# Altium project YaSIf.PrjPcb
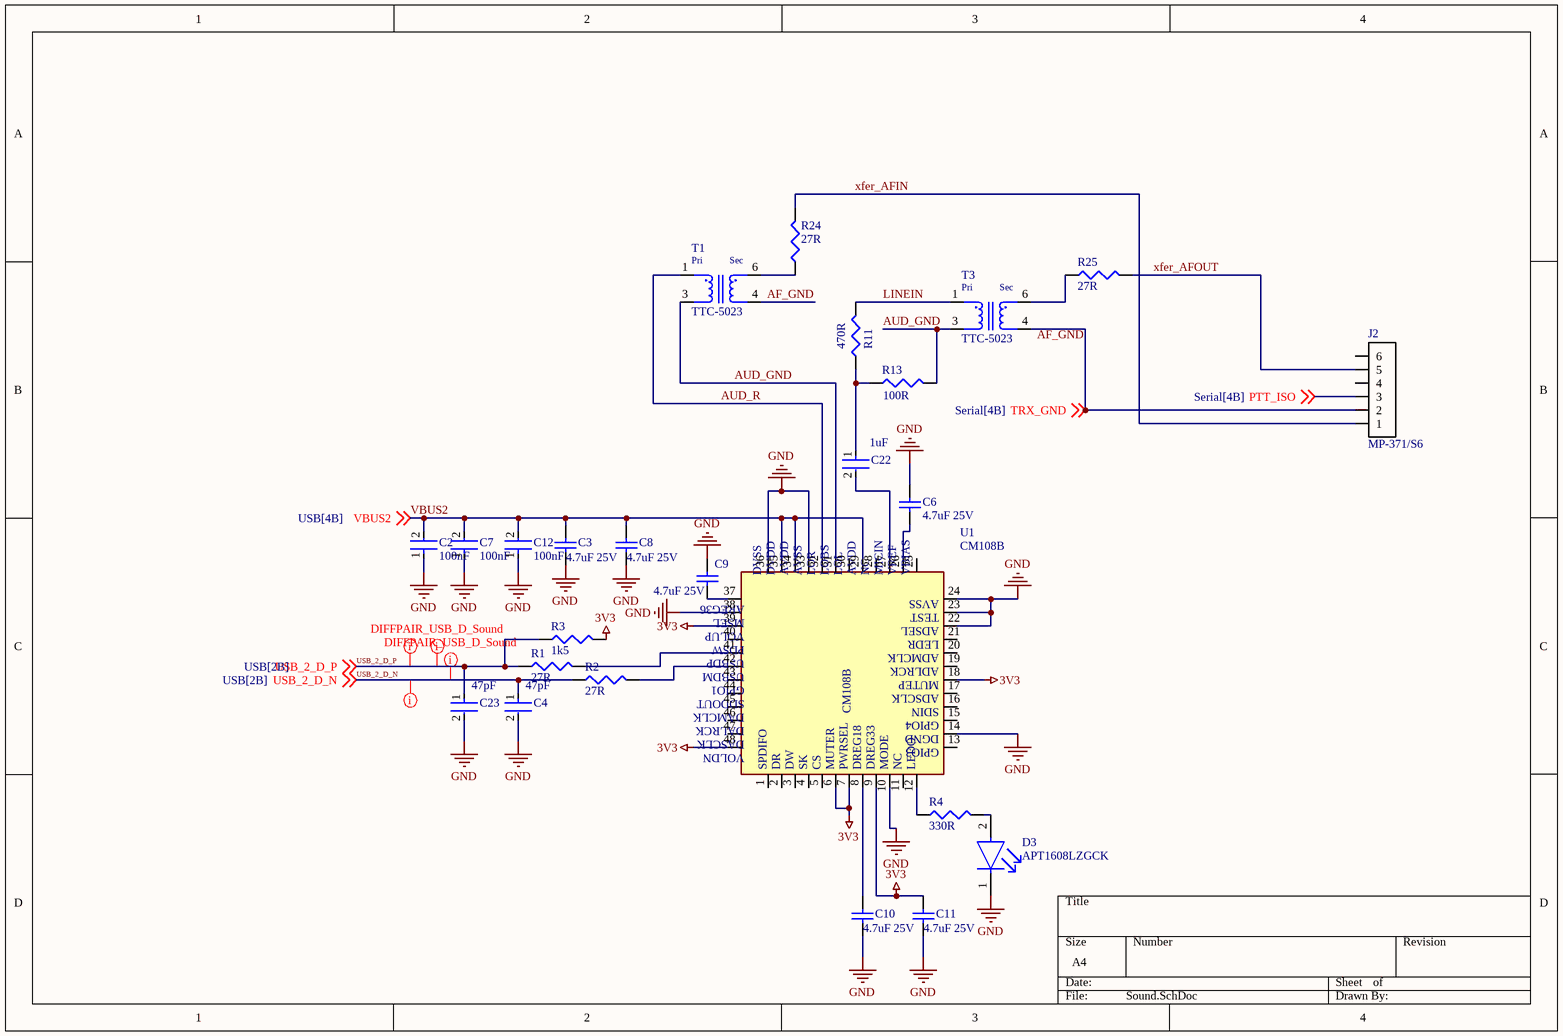
[diagram p0: Sound.SchDoc]
4 sheets, 83 parts. Net scope: global (net labels, ports and power ports of the same name join across sheets).
Board file: PCB.PcbDoc
Sheets:
  Sound.SchDoc
  Serial.SchDoc
  USB.SchDoc
  Power.SchDoc

## Sheet Sound.SchDoc
size A4; SheetNumber: 1; SheetTotal: 4

### Parts
C2  Capacitance: 100nF  [FP-CL10-IPC_B]  (hidden comment: CL10B104KC8NNNC)
C3  4.7uF 25V  [CAPC1210(3225)220_M]
C4  Capacitance: 47pF  [FP-CL10-IPC_C]  (hidden comment: CL10C470JC8NNNC)
C6  4.7uF 25V  [CAPC1210(3225)220_M]
C7  Capacitance: 100nF  [FP-CL10-IPC_B]  (hidden comment: CL10B104KC8NNNC)
C8  4.7uF 25V  [CAPC1210(3225)220_M]
C9  4.7uF 25V  [CAPC1210(3225)220_M]
C10  4.7uF 25V  [CAPC1210(3225)220_M]
C11  4.7uF 25V  [CAPC1210(3225)220_M]
C12  Capacitance: 100nF  [FP-CL10-IPC_B]  (hidden comment: CL10B104KC8NNNC)
C22  Capacitance: 1uF  [FP-CC0603-DB-MFG]  (hidden comment: CC0603KRX7R9BB105)
C23  Capacitance: 47pF  [FP-CL10-IPC_C]  (hidden comment: CL10C470JC8NNNC)
D3  APT1608LZGCK  [FP-APT1608LZGCK-MFG]
J2  MP-371/S6  [MiniDIN6_TopSolder_Lumberg]
R1  27R  [J1-0603]
R2  27R  [J1-0603]
R3  1k5  [J1-0603]
R4  330R  [J1-0603]
R11  470R  [J1-0603]
R13  100R  [J1-0603]
R24  27R  [J1-0603]
R25  27R  [J1-0603]
T1  TTC-5023  [TRANSFORMER_TTC-5023]
T3  TTC-5023  [TRANSFORMER_TTC-5023]
U1  CM108B  [TQFP48]

### Nets
3V3: C11.2 R3.2 U1.6 U1.7 U1.9 U1.18 U1.39 U1.48
AF_GND: J2.2 T1.4 T3.4 ; off-sheet TRX_GND  [also labelled TRX_GND]
GND: C2.1 C3.1 C4.2 C6.1 C7.1 C8.1 C9.2 C10.1 C11.1 C12.1 C23.2 D3.1(C) U1.10 U1.14 U1.22 U1.23 U1.24 U1.33 U1.36 U1.38
AUD_GND: R13.2 T1.3 T3.3 U1.31
AUD_R: T1.1 U1.32
LINEIN: R11.2 T3.1
PTT_ISO: J2.3 ; off-sheet PTT_ISO
USB_2_D_N: C4.1 R2.1 ; off-sheet USB_2_D_N
USB_2_D_P: C23.1 R1.1 R3.1 ; off-sheet USB_2_D_P
VBUS2: C2.2 C3.2 C7.2 C8.2 C12.2 U1.29 U1.34 U1.35 ; off-sheet VBUS2
xfer_AFIN: J2.1 R24.2
xfer_AFOUT: J2.5 R25.2
NetC6_2: C6.2 U1.26
NetC9_1: C9.1 U1.37
NetC10_2: C10.2 U1.8
NetC22_1: C22.1 R11.1 R13.1
NetC22_2: C22.2 U1.27
NetD3_2: D3.2(A) R4.2
NetR1_2: R1.2 U1.41
NetR2_2: R2.2 U1.42
NetR4_1: R4.1 U1.12
NetR24_1: R24.1 T1.6
NetR25_1: R25.1 T3.6

Not connected (* = marked no-connect by the designer): J2 4 6; U1 1 2 3 4 5 11 13 15 16 17 19 20 21 25 28 30 40 43 44 45 46 47

### Layout directives
net class USB_Diff: USB_2_D_N, USB_2_D_P
differential pair: USB_2_D_N, USB_2_D_P

### Notes on the sheet
- (in symbol CMP-002-000000-1) DVSS; DVDD; AVDD; AVSS; LOR; LOBS; LOL; NC; MICIN; VREF; VBIAS; AREG36; MSEL; TEST; VOLUP; ADSEL; PDSW; LEDR; USBDP; ADMCLK; USBDM; ADLRCK; GPIO1; MUTEP; SDDOUT; ADSCLK; DAMCLK; SDIN; DALRCK; GPIO4; DASCLK; DGND; VOLDN; GPIO3; SPDIFO; DR; DW; SK; CS; MUTER; PWRSEL; DREG18; DREG33; MODE; LEDO
- (in symbol CMP-012-00000-1) Pri; Sec

### Library data of the parts
C2 C7 C12 = CMP-13271-004036-1: Cap Ceramic 100nF 100V X7R ±10% Pad SMD 0603 +125°C T/R; Mount: Surface Mount; Packaging: Cut Tape; Width: 0.031inch; Thickness: 0.035inch; Length: 0.063inch; Tolerance: 10%; Min Operating Temperature: -55°C; Case/Package: 0603; Voltage Rating: 100V; Max Operating Temperature: 125°C; Case Code (Metric): 1608; Case Code (Imperial): 0603; JLCPCBPartNum: C15725
C3 C6 C8-C11 = CMP-1038-02151-2: CAP 4.7uF 25V ±10% 1210 (3225 Metric) Thickness 2.2mm SMD; Case-Metric: 3225; Case-EIA: 1210; Tolerance: Â±10%; Value: 4.7uF; Technology: SMT; Max Thickness: 2.2 mm; Rated Voltage: 25 V; JLCPCBPartNum: C86052
C4 C23 = CMP-13271-001416-1: Cap Ceramic 47pF 100V C0G ±5% Pad SMD 0603 +125°C T/R; Tolerance: 5%; Packaging: Tape and Reel; Thickness: 0.035inch; Dielectric: C0G; Max Operating Temperature: 125°C; Radiation Hardening: No; Width: 0.031inch; Height: 0.8mm; Voltage Rating: 100V; Case Code (Imperial): 0603; Voltage Rating (DC): 100V; Case/Package: 0603; Case Code (Metric): 1608; Min Operating Temperature: -55°C; Material: Ceramic; Length: 1.6mm; Mount: Surface Mount; Depth: 0.8mm; JLCPCBPartNum: C1671
C22 = CMP-03422-000761-2: CAP CER 1UF 50V X7R 0603; Tolerance: 10%; Lead Free: Lead Free; Max Operating Temperature: 125°C; Width: 0.031inch; Voltage Rating: 50V; Mount: Surface Mount; Resistor Type: Ceramic; Halogen Free: Halogen Free; Weight: 7.1E-05oz; Voltage Rating (DC): 50V; Package Quantity: 4000; Termination: SMD/SMT; Length: 0.063inch; Min Operating Temperature: -55°C; Dielectric: X7R; Case Code (Metric): 1608; Case Code (Imperial): 0603; Packaging: Tape and Reel; Thickness: 0.035inch; Case/Package: 0603; JLCPCBPartNum: C559769
D3 = CMP-44529-000040-1: LED GREEN CLEAR 2SMD; Dominant Wavelength: 525nm; Forward Voltage: 2.65V; Luminous Intensity: 50mcd; Test Current: 2mA; Viewing Angle: 120°; Lens Color: Colorless; Width: 0.8mm; Mount: Surface Mount; Lens Transparency: Clear; Length: 1.6mm; Packaging: Cut Tape; Case Code (Metric): 1608; Height: 0.75mm; Case/Package: 0603; Case Code (Imperial): 0603; Color: Green; JLCPCBPartNum: C1322302
J2 = MiniDin6_SMT: Miniature circular connectors MP-371/S6; Digikey_PartNum: 2057-MDP-006-ND
R1-R4 R11 R13 R24 R25 = Res3: Resistor; Published: 8-Jun-2000; LatestRevisionDate: 29-May-2009; LatestRevisionNote: IPC-7351 Footprint Added.; PackageReference: J1-0603; Publisher: Altium Limited; PackageDescription: Chip Resistor
  R1 R2 R24 R25: Value: 27R; JLCPCBPartNum: C192531
  R3: Value: 1k5; JLCPCBPartNum: C192164
  R4: Value: 330R; JLCPCBPartNum: C23138
  R11: Value: 470R; JLCPCBPartNum: C25804
  R13: Value: 100R; JLCPCBPartNum: C22775
T1 T3 = CMP-012-00000-1: 600 Impedance Primary Ohms 600 Impedance Secondary Ohms 1:1 Audio Transformer 200Hz ~ 4kHz Surface Mount; MF: Tamura; MP: TTC-5023; SnapEDA_Link: https://www.snapeda.com/parts/TTC-5023/Tamura/view-part/2878352/?ref=snap; Source: SnapEDAsch.SchLib; Design Item ID: TTC-5023; Pins: 4; Availability: Unavailable; Component Type: Standard; Price: None; Case/Package: Tamura; Value: *; JLCPCBPartNum: C840532
U1 = CMP-002-000000-1: USB Audio Codec improved on CM; MF: Cmedia; Check_prices: https://www.snapeda.com/parts/CM108B/Cmedia/view-part/424266/?ref=eda; Pin Count: 48; Source: CM108B.SchLib; Design Item ID: CM108B; Package: None; Price: None; Value: *; SnapEDA_Link: https://www.snapeda.com/parts/CM108B/Cmedia/view-part/424266/?ref=snap; MP: CM108B; Availability: Unavailable; Component Type: Interface; JLCPCBPartNum: C371347

## Sheet Serial.SchDoc
size A4; SheetNumber: 2; SheetTotal: 4
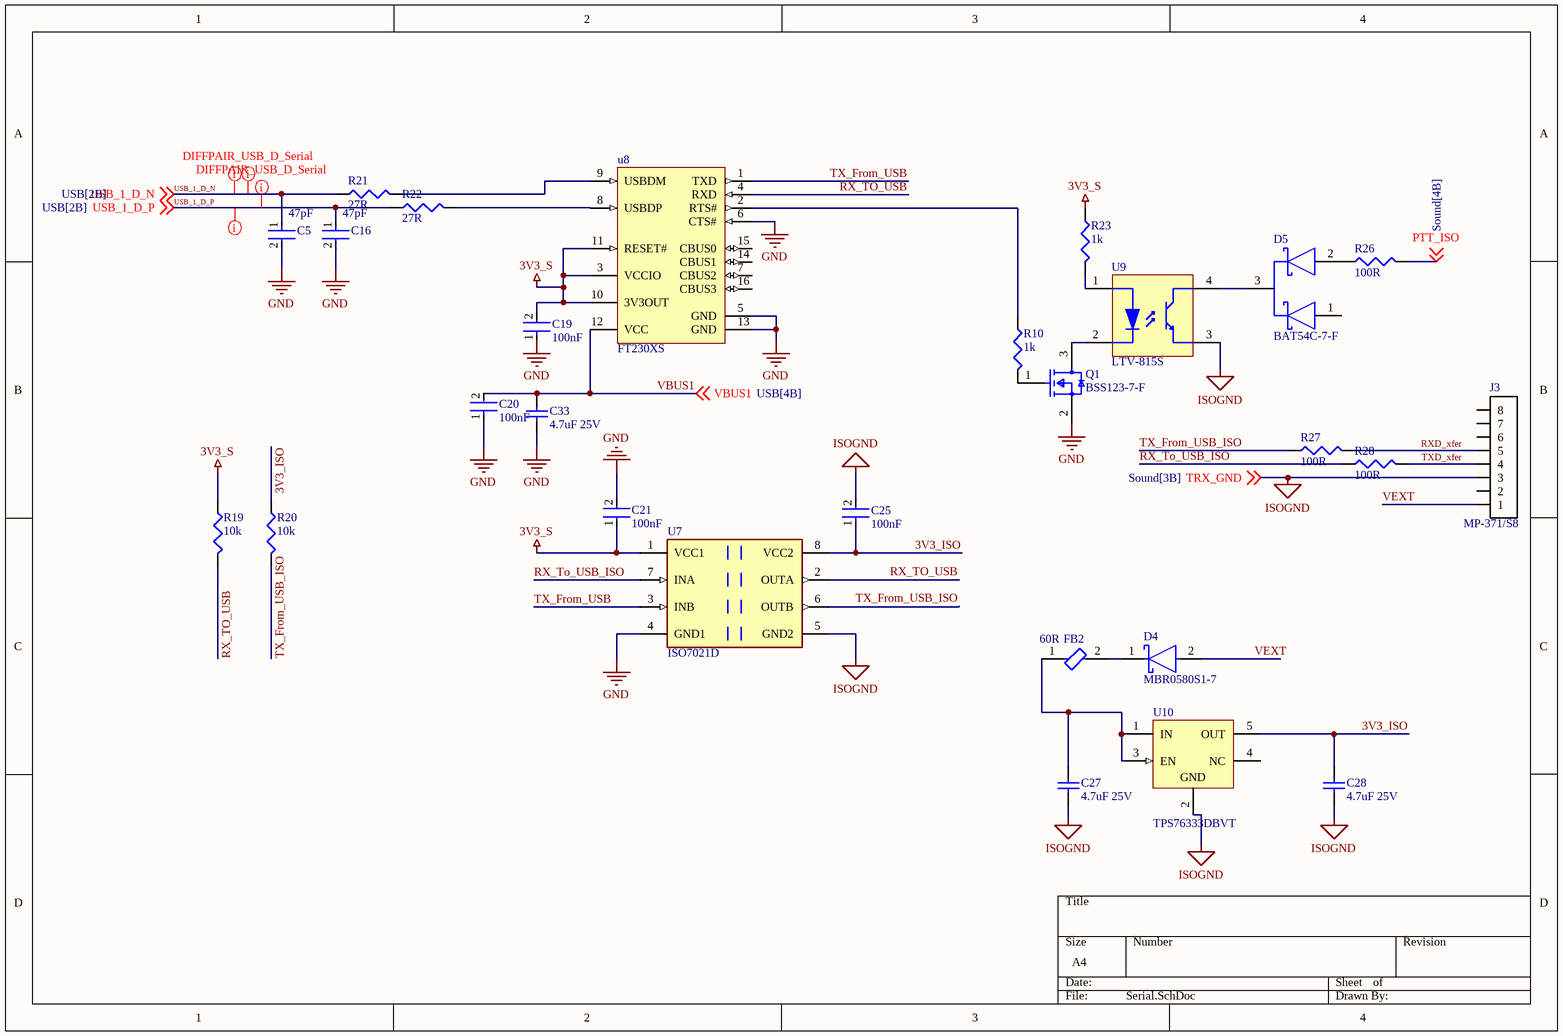
[diagram p1: Serial.SchDoc]

### Parts
C5  Capacitance: 47pF  [FP-CL10-IPC_C]  (hidden comment: CL10C470JC8NNNC)
C16  Capacitance: 47pF  [FP-CL10-IPC_C]  (hidden comment: CL10C470JC8NNNC)
C19  Capacitance: 100nF  [FP-CL10-IPC_B]  (hidden comment: CL10B104KC8NNNC)
C20  Capacitance: 100nF  [FP-CL10-IPC_B]  (hidden comment: CL10B104KC8NNNC)
C21  Capacitance: 100nF  [FP-CL10-IPC_B]  (hidden comment: CL10B104KC8NNNC)
C25  Capacitance: 100nF  [FP-CL10-IPC_B]  (hidden comment: CL10B104KC8NNNC)
C27  4.7uF 25V  [CAPC1210(3225)220_M]
C28  4.7uF 25V  [CAPC1210(3225)220_M]
C33  4.7uF 25V  [CAPC1210(3225)220_M]
D4  MBR0580S1-7  [FP-SOD123-MFG]
D5  BAT54C-7-F  [FP-SOT23-IPC_B]
FB2  Impedance: 60R  [FP-BLM41-0_2-IPC_B]  (hidden comment: BLM41PG600SN1L)
J3  MP-371/S8  [MiniDIN8_TopSolder_Lumberg]
Q1  BSS123-7-F  [FP-SOT23-IPC_C]
R10  1k  [J1-0603]
R19  10k  [J1-0603]
R20  10k  [J1-0603]
R21  27R  [J1-0603]
R22  27R  [J1-0603]
R23  1k  [J1-0603]
R26  100R  [J1-0603]
R27  100R  [J1-0603]
R28  100R  [J1-0603]
U7  ISO7021D  [FP-D0008A-IPC_B]
u8  FT230XS  [FTDI-SSOP-16_L]
U9  LTV-815S  [LTST-LTV-817S-4_V]
U10  TPS76333DBVT  [DBV0005A_N]

### Nets
3V3_S: C19.2 C21.1 R19.1 R23.1 U7.1(VCC1) u8.3(VCCIO) u8.10(3V3OUT) u8.11(RESET#)
GND: C5.2 C16.2 C19.1 C20.1 C21.2 C33.2 Q1.2(S) U7.4(GND1) u8.5(GND) u8.6(CTS#) u8.13(GND)
ISOGND: C25.2 C27.2 C28.2 J3.3 U7.5(GND2) U9.3(EMITTER) U10.2(GND) ; off-sheet TRX_GND  [also labelled TRX_GND]  [project net AF_GND]
3V3_ISO: C25.1 C28.1 R20.1 U7.8(VCC2) U10.5(OUT)
PTT_ISO: R26.2 ; off-sheet PTT_ISO
RX_TO_USB: R19.2 U7.2(OUTA) u8.4(RXD)
RX_To_USB_ISO: R28.1 U7.7(INA)
RXD_xfer: J3.5 R27.2
TX_From_USB: U7.3(INB) u8.1(TXD)
TX_From_USB_ISO: R20.2 R27.1 U7.6(OUTB)
TXD_xfer: J3.4 R28.2
USB_1_D_N: C5.1 R21.1 ; off-sheet USB_1_D_N
USB_1_D_P: C16.1 R22.1 ; off-sheet USB_1_D_P
VBUS1: C20.2 C33.1 u8.12(VCC) ; off-sheet VBUS1
VEXT: D4.2(A) J3.1
NetC27_1: C27.1 FB2.1 U10.1(IN) U10.3(EN)
NetD4_1: D4.1(C) FB2.2
NetD5_2: D5.2(2_ANODE) R26.1
NetD5_3: D5.3(COMMON_CATHODE) U9.4(COLLECTOR)
NetQ1_1: Q1.1(G) R10.2
NetQ1_3: Q1.3(D) U9.2(CATHODE)
NetR10_1: R10.1 u8.2(RTS#)
NetR21_2: R21.2 u8.9(USBDM)
NetR22_2: R22.2 u8.8(USBDP)
NetR23_2: R23.2 U9.1(ANODE)

Not connected (* = marked no-connect by the designer): D5 1(1_ANODE); J3 2 6 7 8; u8 7(CBUS2) 14(CBUS1) 15(CBUS0) 16(CBUS3); U10 4(NC)

### Layout directives
net class USB_Diff: USB_1_D_N, USB_1_D_P
differential pair: USB_1_D_N, USB_1_D_P

### Library data of the parts
C5 C16 = CMP-13271-001416-1: as C4 on sheet Sound; Tolerance: 5%; Packaging: Tape and Reel; Thickness: 0.035inch; Dielectric: C0G; Max Operating Temperature: 125°C; Radiation Hardening: No; Width: 0.031inch; Height: 0.8mm; Voltage Rating: 100V; Case Code (Imperial): 0603; Voltage Rating (DC): 100V; Case/Package: 0603; Case Code (Metric): 1608; Min Operating Temperature: -55°C; Material: Ceramic; Length: 1.6mm; Mount: Surface Mount; Depth: 0.8mm; JLCPCBPartNum: C1671
C19-C21 C25 = CMP-13271-004036-1: as C2 on sheet Sound; Mount: Surface Mount; Packaging: Cut Tape; Width: 0.031inch; Thickness: 0.035inch; Length: 0.063inch; Tolerance: 10%; Min Operating Temperature: -55°C; Case/Package: 0603; Voltage Rating: 100V; Max Operating Temperature: 125°C; Case Code (Metric): 1608; Case Code (Imperial): 0603; JLCPCBPartNum: C15725
C27 C28 C33 = CMP-1038-02151-2: as C3 on sheet Sound; Value: 4.7uF; Technology: SMT; Max Thickness: 2.2 mm; Rated Voltage: 25 V; JLCPCBPartNum: C86052
D4 = CMP-12790-000046-1: DIODE SCHOTTKY 80V 500MA SOD123; Manufacturer: Diodes; Standoff Height: 0mm; Max Surge Forward Current: 14A; Peak Reverse Current: 0.5uA; Capacitance: 15pF; Forward Current: 0.5A; Max Junction Temp: +175°C; Value: 15pF; RoHS: TRUE; Temperature Range High: +175°C; Octopart: https://octopart.com/mbr0580s1-7-diodes+inc.-53081572; Max Repetitive Reverse Voltage: 80V; Height: 1.45mm; Digikey Description: DIODE SCHOTTKY 80V 500MA SOD123; Mouser Description: Schottky Diodes & Rectifiers SBR 0.5A 80Vrrm 14A Ifsm 80Vrrm 15pF; Device Class L2: Diodes; Device Class L1: Discrete Semiconductors; Automotive: No; Reverse Voltage: 80V; Category: Diode; Lead Free: Yes; Footprint Url: https://www.diodes.com/assets/Package-Files/SOD123.pdf; ComponentLink2Description: Datasheet; ComponentLink2URL: https://www.diodes.com/assets/Datasheets/MBR0580S1.pdf; Device Class L3: Schottky Diodes; Manufacturer Part Number: MBR0580S1-7; Package: SOD123; Temperature Range Low: -55°C; Temperature: -55°C to +175°C; JLCPCBPartNum: C177047
D5 = CMP-12790-000084-1: DIODE ARRAY SCHOTTKY 30V SOT23-3; Max Reverse Current: 2uA; Power Dissipation: 200mW; Average Rectified Current: 200mA; Capacitance: 10pF; Peak Non-Repetitive Surge Current: 600mA; Forward Voltage: 800mV; Reverse Recovery Time: 5ns; Element Configuration: Common Cathode; Max Operating Temperature: 150°C; Max Reverse Voltage (DC): 30V; Power Rating: 200mW; Termination: SMD/SMT; REACH SVHC: No SVHC; Voltage Rating (DC): 30V; Series: -; Current Rating: 200mA; RoHS Compliant: Yes; Max Power Dissipation: 200mW; Case/Package: SOT-23; Max Repetitive Reverse Voltage (Vrrm): 30V; Width: 1.3mm; Min Operating Temperature: -65°C; Lead Free: Lead Free; Forward Current: 200mA; Number of Pins: 3; Contact Plating: Tin; Package Quantity: 3000; Length: 2.9mm; Radiation Hardening: No; Max Forward Surge Current (Ifsm): 600mA; Height: 1mm; Packaging: Tape and Reel; Mount: Surface Mount; Weight: 0.000282oz; JLCPCBPartNum: C134405
FB2 = CMP-0686-00754-3: Ferrite Bead, 1806, 60Ω @ 100MHz, 0.009Ω, 6A; Manufacturer Series: BLM41P; Tolerance: 25%; Number of Lines: 1; Shielding: Unshielded; DC Resistance-Max: 9mR; Test Frequency: 100MHz; Case Code (Imperial): 1806; Height: 1.6mm; REACH SVHC: No SVHC; Radiation Hardening: No; Core Material: Ferrite; Case Code (Metric): 4516; Frequency: 100MHz; Number of Circuits: 1; Termination: SMD/SMT; Contact Plating: Tin; Width: 1.6mm; Number of Pins: 2; Package Quantity: 1; Series: BLM41P; Max DC Current: 6A; Inductor Type: FERRITE BEAD; Case/Package: 1806; DC Current: 6A; Number of Functions: 1; Length: 4.5mm; DC Resistance (DCR): 9mR; Terminal Finish: Tin; Military Standard: Not; Min Operating Temperature: -55°C; Depth: 1.6mm; Lead Free: Lead Free; Current: 6A; RoHS Compliant: Yes; Max Current Rating: 6A; Current Rating: 6A; Max Operating Temperature: 125°C; Packaging: Tape and Reel; Material: Ferrite; JLCPCBPartNum: C85844
J3 = MiniDin8_SMT: Miniature circular connectors MP-371/S8; Digikey_PartNum: 2057-MDP-008-ND
Q1 = CMP-12801-000017-1: MOSFET N-CH 100V 170MA SOT23-3; Manufacturer: Diodes Incorporated; Standoff Height: 0.013mm; Power Dissipation: 300mW; Gate To Source Voltage: 20V; Transconductance: 0.37S; Pulse Drain Current: 680mA; Max Forward Diode Voltage: 1.3V; Input Capacitace At Vds: 22pF @ 25V; Number Of N Channels: 1; Threshold Vgs Min: 0.8V; Threshold Vgs Max: 2V; Turn On Delay Time: 8ns; Depletion Mode: False; Typ Forward Diode Voltage: 0.84V; Drain To Source Resistance: 6Ω; Max Junction Temp: +150°C; Rthja Max: 417°C/W; Turn Off Delay Time: 13ns; Automotive Grade: NA; Lead Free: Yes; Manufacturer Part Number: BSS123-7-F; Device Class L1: Discrete Semiconductors; Footprint Url: https://www.diodes.com/assets/Package-Files/SOT23.pdf; Automotive: No; ComponentLink2Description: Datasheet; Octopart: https://octopart.com/bss123-7-f-diodes+inc.-335886; Mouser Description: MOSFET 100V 360mW; RoHS: TRUE; Temperature Range Low: -55°C; Number Of Channels: 1; Device Class L3: MOSFETs; Temperature Range High: +150°C; Drain To Source Breakdown Voltage: 100V; Package: SOT23; Temperature: -55°C to +150°C; Continuous Drain Current: 170mA; Category: Trans; Drain To Source Voltage: 100V; ComponentLink2URL: https://www.diodes.com/assets/Datasheets/ds30366.pdf; Height: 1.1mm; Digikey Description: MOSFET N-CH 100V 170MA SOT23-3; Device Class L2: Transistors; JLCPCBPartNum: C85107
R10 R19-R23 R26-R28 = Res3: Resistor; Published: 8-Jun-2000; LatestRevisionDate: 29-May-2009; LatestRevisionNote: IPC-7351 Footprint Added.; PackageReference: J1-0603; Publisher: Altium Limited; PackageDescription: Chip Resistor
  R10 R23: Value: 1k; JLCPCBPartNum: C21190
  R19 R20: Value: 10k; JLCPCBPartNum: C25804
  R21 R22: Value: 27R; JLCPCBPartNum: C192531
  R26-R28: Value: 100R; JLCPCBPartNum: C22775
U7 = CMP-04872-000022-1: DGTL ISO 3000VRMS 2CH GP 8SOIC
u8 = CMP-2000-06288-1: USB to Basic UART IC, 2.97 to 5.5 V, -40 to 85 degC, 16-Pin SSOP, RoHS; Manufacturer: FTDI; Data Rate: 3Mbaud; USB Standard: USB2.0; USB Type: Transceiver; No. of Pins: 16Pins; Supply Voltage Max: 5.5V; SVHC: NoSVHC(17-Dec-2015); Supply Voltage Min: 2.97V; MSL: MSL3-168hours; Datasheet Version: Rev. 1.4, 05/2016; Interface Case Style: SSOP; Datasheet URL: http://www.ftdichip.com/Support/Documents/DataSheets/ICs/DS_FT230X.pdf; Packaging: CutTape; Package Description: 16-Pin Shrink Small Outline Package Integrated Circuit, Body 4.9 x 3.9 mm, Pitch 0.635 mm; Operating Temperature Min: -40°C; Mounting Technology: SurfaceMount; Package Reference: SSOP-16; Manufacturer URL: http://www.ftdichip.com/; Product Range: -; Operating Temperature Max: 85°C; No. of Ports: -; JLCPCBPartNum: C69082
U9 = CMP-2000-05204-1: Photocoupler - Phototransistor Output, 35 V VCEO, -50 to 110 degC, 4-Pin SMD, RoHS, Tape and Reel; Manufacturer: Lite-On; Collector Current (DC): 0.05A; Collector-Emitter Voltage: 35V; Fall Time: 18000ns; Reverse Breakdown Voltage: 6V; Forward Voltage: 1.4V; Output Type: DC; Forward Current: 50mA; Isolation Voltage: 5000V; Number of Elements: 1; Rad Hardened: No; Power Dissipation: 0.2W; Current Transfer Ratio: 600%; DELETED: Compliant; Collector-Emitter Saturation Voltage: 0.2V; Package Type: PDIPSMD; Collector Current (DC) (Max): 0.05A; Manufacturer URL: http://www.us.liteon.com/; Rise Time: 18000ns; Operating Temperature Classification: Commercial; Output Device: Transistor; Input Type: DC; Datasheet Version: Jan-10; Operating Temp Range: -30Cto100C; Mounting: SurfaceMount; Pin Count: 4; JLCPCBPartNum: C115455
U10 = CMP-0394-00563-2: Single Output LDO, 150 mA, Fixed 3.3 V Output, 2.7 to 10 V Input, with Low IQ, 5-pin SOT-23 (DBV), -40 to 125 degC, Green (RoHS & no Sb/Br); Manufacturer: Texas Instruments; Vin(Max)(V): 10; Iq(Typ)(mA): 0.08; Accuracy(%): 3; Vout Adj(Max)(V): 3.3; Iout(Max)(A): 0.15; Vin(Min)(V): 2.7; Vdo(Typ)(mV): 300; SubFamily: Single Channel LDO; ComponentLink2URL: http://www.ti.com/general/docs/lit/getliterature.tsp?genericPartNumber=TPS76333&fileType=pdf; ComponentLink2Description: Datasheet; Code_JEDEC: MO-178; PartNumber: TPS76333DBVT; Vout Adj(Min)(V): 3.3; PackageDescription: 5-Pin Plastic Small Outline, Body 1.60 Ãƒâ€” 2.90 mm, Pitch 0.95 mm; Eco-Plan: Green (RoHS & no Sb/Br); PackageReference: DBV0005A; Mounting Technology: Surface Mount; ComponentLink3Description: Package Specification; DatasheetVersion: SLVS181H; ComponentLink3URL: http://www.ti.com/litv/pdf/mpds018i; PackageVersion: 4073253-4/K; Fixed Output Options(V): 3.3; ComponentLink1URL: http://www.ti.com/; ComponentLink1Description: Manufacturer URL; JLCPCBPartNum: C7100

## Sheet USB.SchDoc
size A4; SheetNumber: 3; SheetTotal: 4
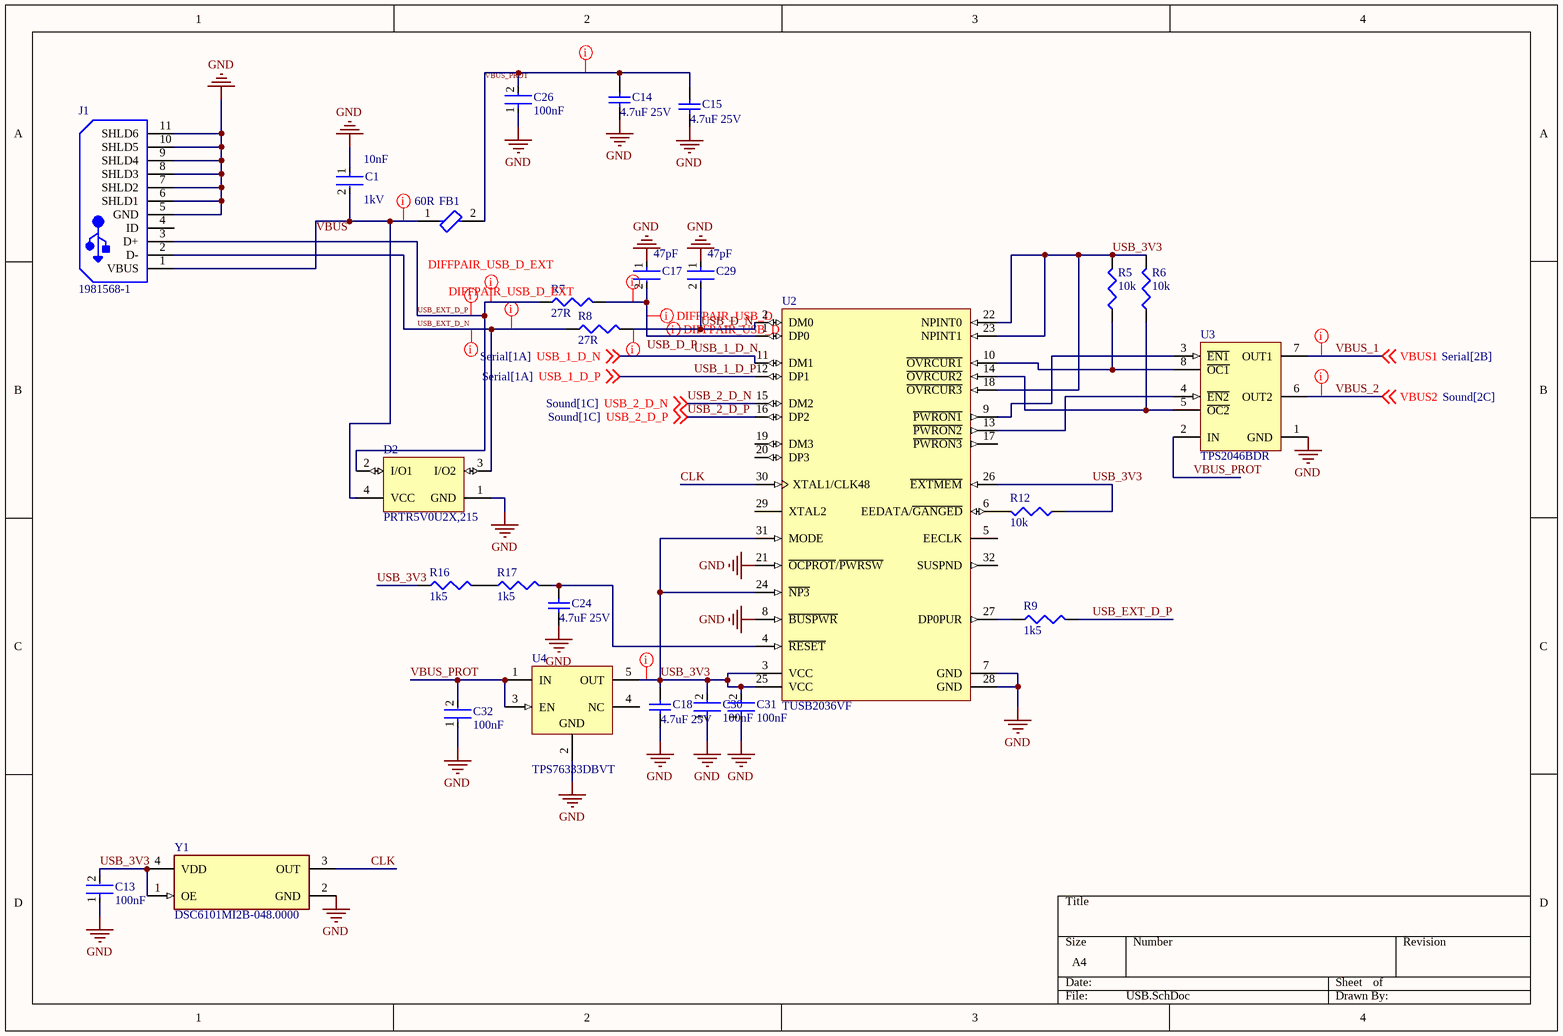
[diagram p2: USB.SchDoc]

### Parts
C1  Voltage Rating (DC): 1kV  Capacitance: 10nF  [FP-C4532-200-0_4-IPC_B]  (hidden comment: C4532X7R3A103K200KA)
C13  Capacitance: 100nF  [FP-CL10-IPC_B]  (hidden comment: CL10B104KC8NNNC)
C14  4.7uF 25V  [CAPC1210(3225)220_M]
C15  4.7uF 25V  [CAPC1210(3225)220_M]
C17  Capacitance: 47pF  [FP-CL10-IPC_C]  (hidden comment: CL10C470JC8NNNC)
C18  4.7uF 25V  [CAPC1210(3225)220_M]
C24  4.7uF 25V  [CAPC1210(3225)220_M]
C26  Capacitance: 100nF  [FP-CL10-IPC_B]  (hidden comment: CL10B104KC8NNNC)
C29  Capacitance: 47pF  [FP-CL10-IPC_C]  (hidden comment: CL10C470JC8NNNC)
C30  Capacitance: 100nF  [FP-CL10-IPC_B]  (hidden comment: CL10B104KC8NNNC)
C31  Capacitance: 100nF  [FP-CL10-IPC_B]  (hidden comment: CL10B104KC8NNNC)
C32  Capacitance: 100nF  [FP-CL10-IPC_B]  (hidden comment: CL10B104KC8NNNC)
D2  PRTR5V0U2X,215  [NXP-SOT143B-4_V]
FB1  Impedance: 60R  [FP-BLM41-0_2-IPC_B]  (hidden comment: BLM41PG600SN1L)
J1  1981568-1  [TECO-1981568-5_V]
R5  10k  [J1-0603]
R6  10k  [J1-0603]
R7  27R  [J1-0603]
R8  27R  [J1-0603]
R9  1k5  [J1-0603]
R12  10k  [J1-0603]
R16  1k5  [J1-0603]
R17  1k5  [J1-0603]
U2  TUSB2036VF  [VF0032A_N]
U3  TPS2046BDR  [D0008A_L]
U4  TPS76333DBVT  [DBV0005A_N]
Y1  DSC6101MI2B-048.0000  [FP-C04-C04-1200-0]

### Nets
GND: C1.1 C13.1 C14.1 C15.1 C17.1 C18.1 C24.1 C26.1 C29.1 C30.1 C31.1 C32.1 D2.1(GND) J1.5(GND) J1.6(SHLD1) J1.7(SHLD2) J1.8(SHLD3) J1.9(SHLD4) J1.10(SHLD5) J1.11(SHLD6) U2.7(GND) U2.8(~{BUSPWR}) U2.21(~{OCPROT}/~{PWRSW}) U2.28(GND) U3.1(GND) U4.2(GND) Y1.2(GND)
CLK: U2.30(XTAL1/CLK48) Y1.3(OUT)
USB_1_D_N: U2.11(DM1) ; off-sheet USB_1_D_N
USB_1_D_P: U2.12(DP1) ; off-sheet USB_1_D_P
USB_2_D_N: U2.15(DM2) ; off-sheet USB_2_D_N
USB_2_D_P: U2.16(DP2) ; off-sheet USB_2_D_P
USB_3V3: C13.2 C18.2 C30.2 C31.2 R5.2 R6.2 R12.1 R16.1 U2.3(VCC) U2.18(~{OVRCUR3}) U2.22(NPINT0) U2.23(NPINT1) U2.24(~{NP3}) U2.25(VCC) U2.26(~{EXTMEM}) U2.31(MODE) U4.5(OUT) Y1.1(OE) Y1.4(VDD)
USB_D_N: C29.2 R8.2 U2.2(DM0)
USB_D_P: C17.2 R7.2 U2.1(DP0)
USB_EXT_D_N: D2.3(I/O2) J1.2(D-) R8.1
USB_EXT_D_P: D2.2(I/O1) J1.3(D+) R7.1 R9.2
VBUS: C1.2 D2.4(VCC) FB1.1 J1.1(VBUS)
VBUS1: U3.7(OUT1) ; off-sheet VBUS1  [also labelled VBUS_1]
VBUS2: U3.6(OUT2) ; off-sheet VBUS2  [also labelled VBUS_2]
VBUS_PROT: C14.2 C15.2 C26.2 C32.2 FB1.2 U3.2(IN) U4.1(IN) U4.3(EN)
NetC24_2: C24.2 R17.2 U2.4(~{RESET})
NetR5_1: R5.1 U2.10(~{OVRCUR1}) U3.8(~{OC1})
NetR6_1: R6.1 U2.14(~{OVRCUR2}) U3.5(~{OC2})
NetR9_1: R9.1 U2.27(DP0PUR)
NetR12_2: R12.2 U2.6(EEDATA/~{GANGED})
NetR16_2: R16.2 R17.1
NetU2_9: U2.9(~{PWRON1}) U3.3(~{EN1})
NetU2_13: U2.13(~{PWRON2}) U3.4(~{EN2})

Not connected (* = marked no-connect by the designer): J1 4(ID); U2 5(EECLK) 17(~{PWRON3}) 19(DM3) 20(DP3) 29(XTAL2) 32(SUSPND); U4 4(NC)

### Layout directives
net class USB_Diff: USB_D_N, USB_D_P, USB_EXT_D_N, USB_EXT_D_P
net class USB_Pwr: USB_3V3, VBUS, VBUS1, VBUS2, VBUS_PROT
differential pair: USB_D_N, USB_D_P, USB_EXT_D_N, USB_EXT_D_P

### Library data of the parts
C1 = CMP-08246-006993-1: Multilayer Ceramic Capacitors 10nF ±10% 1000V X7R SMD 1812; Min Operating Temperature: -55°C; Number of Pins: 2; RoHS Compliant: Yes; Thickness: 0.087inch; Mount: Surface Mount; Voltage Rating: 1kV; Package Quantity: 1; Packaging: Tape and Reel; Width: 0.126inch; Lead Free: Lead Free; Dielectric: X7R; Weight: 0.000952oz; REACH SVHC: No SVHC; Case Code (Imperial): 1812; Max Operating Temperature: 125°C; Resistor Type: Ceramic; Case/Package: 1812; Depth: 3.2mm; Case Code (Metric): 4532; Tolerance: 10%; Series: C; Termination: SMD/SMT; Length: 4.5mm; JLCPCBPartNum: C577346
C13 C26 C30-C32 = CMP-13271-004036-1: as C2 on sheet Sound; Mount: Surface Mount; Packaging: Cut Tape; Width: 0.031inch; Thickness: 0.035inch; Length: 0.063inch; Tolerance: 10%; Min Operating Temperature: -55°C; Case/Package: 0603; Voltage Rating: 100V; Max Operating Temperature: 125°C; Case Code (Metric): 1608; Case Code (Imperial): 0603; JLCPCBPartNum: C15725
C14 C15 C18 C24 = CMP-1038-02151-2: as C3 on sheet Sound; Value: 4.7uF; Technology: SMT; Max Thickness: 2.2 mm; Rated Voltage: 25 V; JLCPCBPartNum: C86052
C17 C29 = CMP-13271-001416-1: as C4 on sheet Sound; Tolerance: 5%; Packaging: Tape and Reel; Thickness: 0.035inch; Dielectric: C0G; Max Operating Temperature: 125°C; Radiation Hardening: No; Width: 0.031inch; Height: 0.8mm; Voltage Rating: 100V; Case Code (Imperial): 0603; Voltage Rating (DC): 100V; Case/Package: 0603; Case Code (Metric): 1608; Min Operating Temperature: -55°C; Material: Ceramic; Length: 1.6mm; Mount: Surface Mount; Depth: 0.8mm; JLCPCBPartNum: C1671
D2 = CMP-2000-05285-1: Ultra Low Capacitance Double Rail-to-Rail ESD Protection Diode, 5.5 V, 1 pF, -40 to 85 degC, 4-Pin SOT143B, RoHS, Tape and Reel; Manufacturer: NXP Semiconductors; Capacitance Value: 16pF; Number of Elements: 1; Rad Hardened: No; Reverse Breakdown Voltage: 6V; Working Voltage (Max): 5.5V; Polarity: Uni-Directional; Configuration: Quad; Leakage Current: 0.1uA; Product Height (mm): 1mm; Suppressor Type: DiodeArrays; Product Length (mm): 3mm; Product Depth (mm): 1.4mm; ESD Protection Voltage: 8KV@ContactDisc; Package Type: SOT; Mounting: SurfaceMount; Packaging: TapeandReel; Datasheet Version: Rev. 02, 01/2008; Reverse Stand-off Voltage: 5.5V; Manufacturer URL: http://www.nxp.com/; Operating Temp Range: -40Cto85C; Operating Temperature Classification: Industrial; Working Voltage: 5.5V; Operating Temperature Min Deg. C: -40C; Datasheet URL: https://datasheet.ciiva.com/4479/prtr5v0u2x-102853-4479461.pdf; Leakage Current (Max): 0.1uA; Direction Type: Uni-Directional; Pin Count: 3+Tab; Operating Temperature Max Deg. C: 85C; Mounting Style: SurfaceMount; Package / Case: SOT; JLCPCBPartNum: C12333
FB1 = CMP-0686-00754-3: as FB2 on sheet Serial; Test Frequency: 100MHz; Case Code (Imperial): 1806; Height: 1.6mm; REACH SVHC: No SVHC; Radiation Hardening: No; Core Material: Ferrite; Case Code (Metric): 4516; Frequency: 100MHz; Number of Circuits: 1; Termination: SMD/SMT; Contact Plating: Tin; Width: 1.6mm; Number of Pins: 2; Package Quantity: 1; Series: BLM41P; Max DC Current: 6A; Inductor Type: FERRITE BEAD; Case/Package: 1806; DC Current: 6A; Number of Functions: 1; Length: 4.5mm; DC Resistance (DCR): 9mR; Terminal Finish: Tin; Military Standard: Not; Min Operating Temperature: -55°C; Depth: 1.6mm; Lead Free: Lead Free; Current: 6A; RoHS Compliant: Yes; Max Current Rating: 6A; Current Rating: 6A; Max Operating Temperature: 125°C; Packaging: Tape and Reel; Material: Ferrite; JLCPCBPartNum: C85844
J1 = CMP-2000-05408-1: Micro USB Receptacle Standard Type B Assy, 5-Pin SMD, RoHS, Tape and Reel; Manufacturer: TE Connectivity; Body Orientation: RightAngle; Number of Ports: 1Port; Number of Contacts: 5POS; Gender: RCP; Voltage Rating Max: 30VAC; Product Depth (mm): 5.6mm; Pitch (mm): 0.65mm; Current Rating (Max): 1/ContactA; Product Length (mm): 8mm; Product Height (mm): 3mm; Operating Temperature Max Deg. C: 85C; Datasheet URL: http://www.mouser.com/ds/2/418/NG_CD_1981568_E2-621296.pdf; Termination Method: Solder; Number of Terminals: 5; Operating Temp Range: -55Cto85C; Mounting Style: SurfaceMount; Manufacturer URL: http://www.te.com/; Contact Material: CopperAlloy; Packaging: TapeandReel; Datasheet Version: Rev. E2, 08/2015; Operating Temperature Min Deg. C: -55C; Housing Material: Thermoplastic; Type: MicroUSB; Contact Plating: GoldOverNickel; JLCPCBPartNum: C428487
R5-R9 R12 R16 R17 = Res3: Resistor; Published: 8-Jun-2000; LatestRevisionDate: 29-May-2009; LatestRevisionNote: IPC-7351 Footprint Added.; PackageReference: J1-0603; Publisher: Altium Limited; PackageDescription: Chip Resistor
  R5 R6 R12: Value: 10k; JLCPCBPartNum: C25804
  R7 R8: Value: 27R; JLCPCBPartNum: C192531
  R9 R16 R17: Value: 1k5; JLCPCBPartNum: C192164
U2 = CMP-0309-00077-2: 2 / 3-Port Hub for USB with Optional Serial EEPROM Interface, 3.3V, 0 to 70 degC, 32-Pin LQFP (VF), Green (RoHS & no Sb/Br); Manufacturer: Texas Instruments; USB Speed: Full; Supply Voltage(s)(V): 3.3; SubFamily: USB Hub Controller; USB Full Speed: True; ComponentLink2Description: Package Specification; Eco-Plan: Green (RoHS & no Sb/Br); ComponentLink1Description: Datasheet; ComponentLink2URL: http://www.ti.com/litv/pdf/mtqf002b; PackageVersion: revD, Apr-2000; PartNumber: TUSB2036VF; PackageReference: VF0032A; ComponentLink1URL: http://www.ti.com/general/docs/lit/getliterature.tsp?genericPartNumber=TUSB2036&fileType=pdf; Mounting Technology: Surface Mount; Integrated MCU Architecture: N/A; PackageDescription: 32-Pin Plastic Quad Flatpack, 7 x 7 mm Body, 0.8 mm Pitch; DatasheetVersion: SLLS372E; JLCPCBPartNum: C43665
U3 = CMP-0337-00031-2: Current-Limited Power-Distribution Switch, 0.5 A Current Limit, -40 to 85 degC, 8-pin SOIC (D), Green (RoHS & no Sb/Br); Manufacturer: Texas Instruments; Continuous Current(Max)(A): 0.25; UL Listed: TRUE; Vin(Min)(V): 2.7; Rating: Catalog; Current Limit(A): 0.5; rDS(on) per FET(Typ)(mOhms): 70; Number of Switches: 2; Vin(Max)(V): 5.5; Enable: Active Low; ComponentLink1Description: Datasheet; Code_JEDEC: MS-012AA; PackageDescription: 8-Pin Plastic Small Outline Integrated Circuit, 4.9 x 3.9 mm, Pitch 1.27 mm Pitch; PackageReference: D0008A; DatasheetVersion: SLVS532C; NEMKO: TRUE; Mounting Technology: Surface Mount; ComponentLink1URL: http://www.ti.com/general/docs/lit/getliterature.tsp?genericPartNumber=TPS2046B&fileType=pdf; PackageVersion: revM, Jun-2011; PartNumber: TPS2046BDR; Eco-Plan: Green (RoHS & no Sb/Br)
U4 = CMP-0394-00563-2: as U10 on sheet Serial; ComponentLink2URL: http://www.ti.com/general/docs/lit/getliterature.tsp?genericPartNumber=TPS76333&fileType=pdf; ComponentLink2Description: Datasheet; Code_JEDEC: MO-178; PartNumber: TPS76333DBVT; Vout Adj(Min)(V): 3.3; PackageDescription: 5-Pin Plastic Small Outline, Body 1.60 Ãƒâ€” 2.90 mm, Pitch 0.95 mm; Eco-Plan: Green (RoHS & no Sb/Br); PackageReference: DBV0005A; Mounting Technology: Surface Mount; ComponentLink3Description: Package Specification; DatasheetVersion: SLVS181H; ComponentLink3URL: http://www.ti.com/litv/pdf/mpds018i; PackageVersion: 4073253-4/K; Fixed Output Options(V): 3.3; ComponentLink1URL: http://www.ti.com/; ComponentLink1Description: Manufacturer URL; JLCPCBPartNum: C7100
Y1 = CMP-06255-000002-1: MEMS OSC XO 48.0000MHZ CMOS SMD; Manufacturer Part Number: DSC6101MI2A-024.0000T; Manufacturer: Microchip; Max Supply Voltage: 3.63V; Standoff Height: 0mm; Stability: 25ppm; Frequency: 24MHz; Max Junction Temp: +150°C; Min Supply Voltage: 1.71V; Ambient Temperature Range High: +85°C; Series: DSC61; Device Class L3: Oscillators; Package: C04-C04-1200; ComponentLink2URL: http://ww1.microchip.com/downloads/en/DeviceDoc/20005624B.pdf; Automotive: No; Ambient Temperature Range Low: -40°C; Category: Crys; ComponentLink2Description: Datasheet; Device Class L1: Passive Components; Temperature Range High: +150°C; Digikey Description: MEMS OSC XO 24.0000MHZ CMOS SMD; Mouser Description: Ultra-Low Power, Mems Oscillator, 2016, -40 To 85, 25Ppm4 Vflga 2.0X1.6X0.89Mm T/R; Height: 0.89mm; Octopart: https://octopart.com/dsc6101mi2a-024.0000t-microchip-75516980; Footprint Url: http://ww1.microchip.com/downloads/en/DeviceDoc/04L_VFLGA_2-0x1-6x0-89_ASA_C04-01200b.pdf; Temperature: to +150°C; Device Class L2: Crystals / Oscillators; RoHS: TRUE; Lead Free: Yes; JLCPCBPartNum: C1671481

## Sheet Power.SchDoc
size A4; SheetNumber: 4; SheetTotal: 4
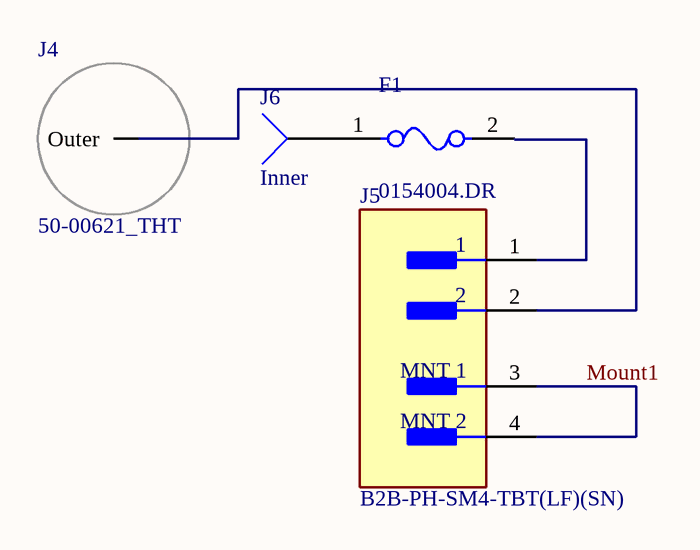
[diagram p3: Power.SchDoc]

### Parts
F1  0154004.DR  [FP-0154-MFG]
J4  50-00621_THT  [50-00621_THT]
J5  B2B-PH-SM4-TBT(LF)(SN)  [FP-B2B-PH-SM4-TBT_LF_SN-MFG]
J6  Inner  [PIN1]  (no BOM)

### Nets
Mount1: J5.3(MNT_1) J5.4(MNT_2)
NetF1_1: F1.1 J6.1
NetF1_2: F1.2 J5.1
NetJ4_1: J4.1(Outer) J5.2

### Library data of the parts
F1 = CMP-08605-000003-1: FUSE BRD MNT 4A 125VAC/VDC 2SMD; Manufacturer: Littelfuse; Fuse Blow Speed: Fast; Max Fuse Ac Voltage: 125V; Lead Free: Yes; Device Class L3: unset; Manufacturer Part Number: 0154004.DR; Device Class L2: Fuses; Package: 0154; ComponentLink2Description: Datasheet; Temperature Range Low: -55°C; Temperature Range High: +125°C; Device Class L1: Circuit Protection; Height: 3.81mm; Temperature: -55°C to +125°C; Mouser Description: Surface Mount Fuses Fuseblock w/ fuse 4A OMNI BLOK 154; Automotive: No; Digikey Description: FUSE BRD MNT 4A 125VAC/VDC 2SMD; RoHS: TRUE; Category: Fuse; Fuse Current: 4A; Max Fuse Dc Voltage: 125V; ComponentLink2URL: https://www.littelfuse.com/~/media/electronics/datasheets/fuses/littelfuse_fuse_154_154t_154l_154tl_datasheet.pdf.pdf; Octopart: https://octopart.com/0154004.dr-littelfuse-565861; JLCPCBPartNum: C206914
J4 = 50-00621: Tensility Connector, dc plug, 4.0x1.7x21.3 mm, dual solder tabs, spring contacts, nickel plated, 105 °C
J5 = CMP-17439-000005-1: CONN HEADER SMD 2POS 2MM; Manufacturer: JST; Current Rating: 2A; Conn Gender: Male; Voltage Rating: 100V; Conn Orientation: Vertical; Number Of Contacts: 2; Octopart: https://octopart.com/b2b-ph-sm4-tbt%28lf%29%28sn%29-jst-7877930; Number Of Rows: 1; Device Class L2: Headers and Wire Housings; RoHS: TRUE; Contact Material: Tin,Copper; Height: 6.65mm; Temperature: -25°C to +85°C; Temperature Range Low: -25°C; ComponentLink2Description: Datasheet; Manufacturer Part Number: B2B-PH-SM4-TBT(LF)(SN); ComponentLink2URL: http://www.jst-mfg.com/product/pdf/eng/ePH.pdf; Automotive: No; Pitch: 2mm; Lead Free: Yes; Device Class L3: unset; Category: Conn; Digikey Description: CONN HEADER SMD 2POS 2MM; Temperature Range High: +85°C; Package: 0; Device Class L1: Connectors; JLCPCBPartNum: C265003
J6 = Socket: LatestRevisionDate: 17-Jul-2002; LatestRevisionNote: Re-released for DXP Platform.; Publisher: Altium Limited

## Nets that join several sheets
AF_GND: Sound (J2.2 T1.4 T3.4), Serial (7 pins)
GND: Sound (20 pins), Serial (11 pins), USB (27 pins)
PTT_ISO: Sound (J2.3), Serial (R26.2)
USB_1_D_N: Serial (C5.1 R21.1), USB (U2.11)
USB_1_D_P: Serial (C16.1 R22.1), USB (U2.12)
USB_2_D_N: Sound (C4.1 R2.1), USB (U2.15)
USB_2_D_P: Sound (C23.1 R1.1 R3.1), USB (U2.16)
VBUS1: Serial (C20.2 C33.1 u8.12), USB (U3.7)
VBUS2: Sound (8 pins), USB (U3.6)

## Assembly variants
JLC_SMT: not fitted C4 C5 C29 C30 D3 J2 J3 J4 J6